# Altium project FastestCar_Ctl.PrjPcb
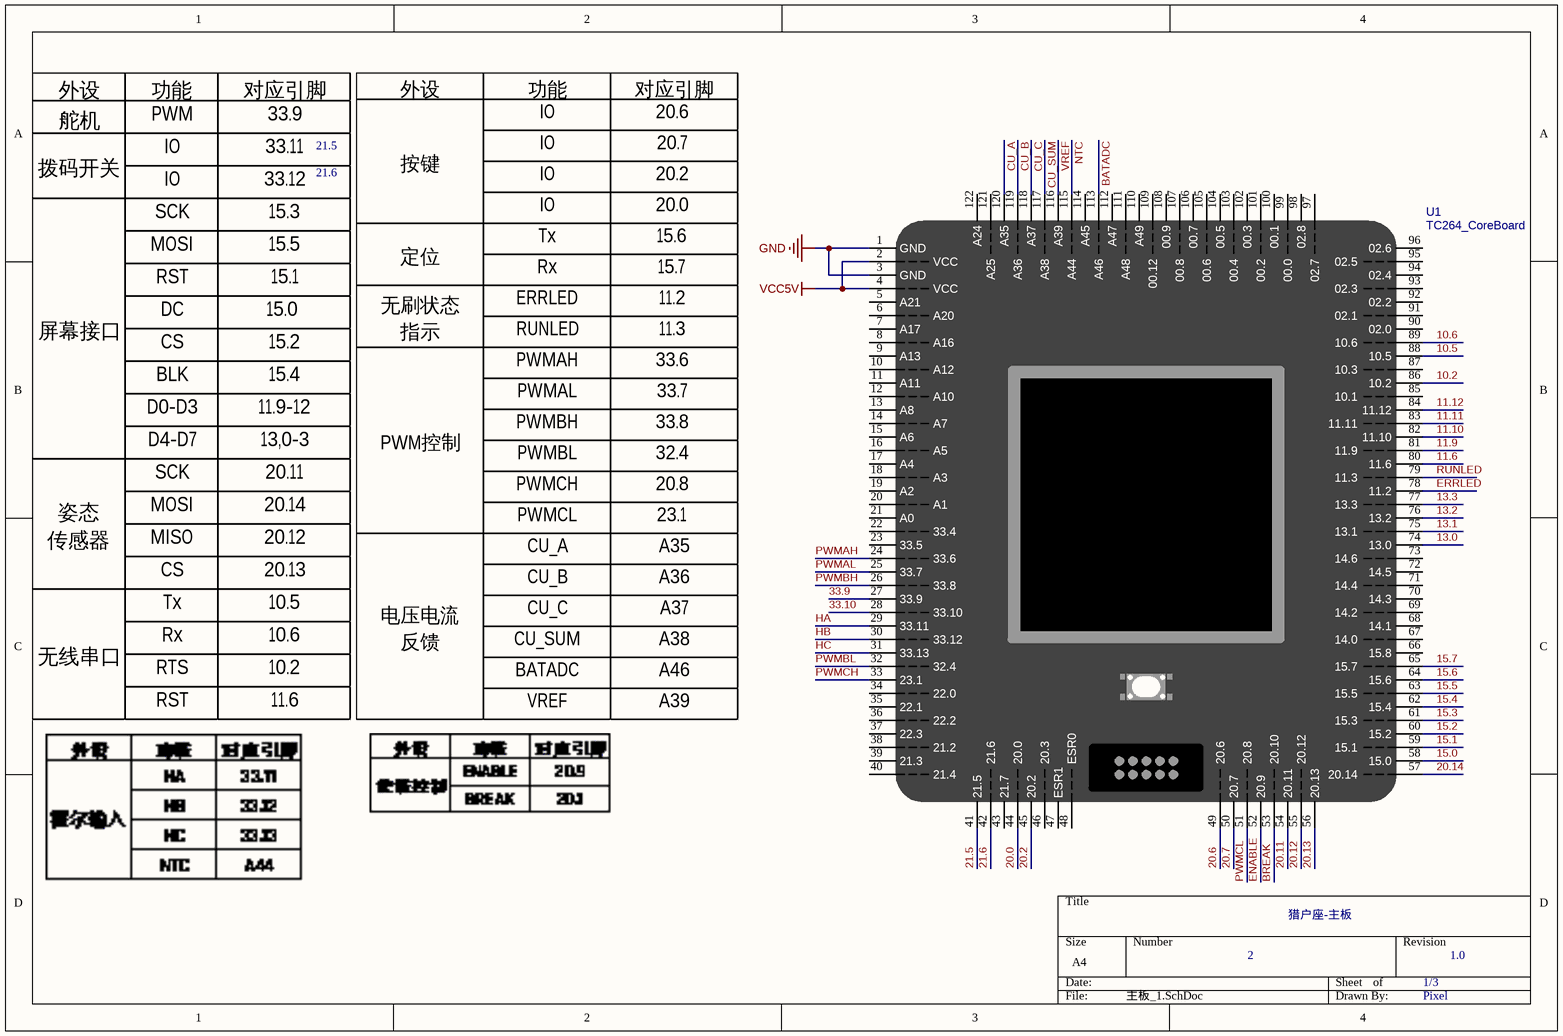
[diagram p0: 主板_1.SchDoc]
3 sheets, 125 parts. Net scope: global (net labels, ports and power ports of the same name join across sheets).
Board file: 主板.PcbDoc
Sheets:
  主板_1.SchDoc
  主板_2.SchDoc
  主板_3.SchDoc

## Sheet 主板_1.SchDoc
size A4; SheetNumber: 1; SheetTotal: 3

### Parts
U1  TC264_CoreBoard  [TC264_CoreBoard]

### Nets
GND: U1.1(GND) U1.3(GND)
VCC5V: U1.2(VCC) U1.4(VCC)
10.2: U1.86(10.2)
10.5: U1.88(10.5)
10.6: U1.89(10.6)
11.6: U1.80(11.6)
11.9: U1.81(11.9)
11.10: U1.82(11.10)
11.11: U1.83(11.11)
11.12: U1.84(11.12)
13.0: U1.74(13.0)
13.1: U1.75(13.1)
13.2: U1.76(13.2)
13.3: U1.77(13.3)
15.0: U1.58(15.0)
15.1: U1.59(15.1)
15.2: U1.60(15.2)
15.3: U1.61(15.3)
15.4: U1.62(15.4)
15.5: U1.63(15.5)
15.6: U1.64(15.6)
15.7: U1.65(15.7)
20.0: U1.44(20.0)
20.2: U1.45(20.2)
20.6: U1.49(20.6)
20.7: U1.50(20.7)
20.11: U1.54(20.11)
20.12: U1.55(20.12)
20.13: U1.56(20.13)
20.14: U1.57(20.14)
21.5: U1.41(21.5)
21.6: U1.42(21.6)
33.9: U1.27(33.9)
33.10: U1.28(33.10)
BATADC: U1.113(A46)
BREAK: U1.53(20.10)
CU_A: U1.120(A35)
CU_B: U1.119(A36)
CU_C: U1.118(A37)
CU_SUM: U1.117(A38)
ENABLE: U1.52(20.9)
ERRLED: U1.78(11.2)
HA: U1.29(33.11)
HB: U1.30(33.12)
HC: U1.31(33.13)
NTC: U1.115(A44)
PWMAH: U1.24(33.6)
PWMAL: U1.25(33.7)
PWMBH: U1.26(33.8)
PWMBL: U1.32(32.4)
PWMCH: U1.33(23.1)
PWMCL: U1.51(20.8)
RUNLED: U1.79(11.3)
VREF: U1.116(A39)

Not connected (* = marked no-connect by the designer): U1 5(A21) 6(A20) 7(A17) 8(A16) 9(A13) 10(A12) 11(A11) 12(A10) 13(A8) 14(A7) 15(A6) 16(A5) 17(A4) 18(A3) 19(A2) 20(A1) 21(A0) 22(33.4) 23(33.5) 34(22.0) 35(22.1) 36(22.2) 37(22.3) 38(21.2) 39(21.3) 40(21.4) 43(21.7) 46(20.3) 47(ESR1) 48(ESR0) 66(15.8) 67(14.0) 68(14.1) 69(14.2) 70(14.3) 71(14.4) 72(14.5) 73(14.6) 85(10.1) 87(10.3) 90(02.0) 91(02.1) 92(02.2) 93(02.3) 94(02.4) 95(02.5) 96(02.6) 97(02.7) 98(02.8) 99(00.0) 100(00.1) 101(00.2) 102(00.3) 103(00.4) 104(00.5) 105(00.6) 106(00.7) 107(00.8) 108(00.9) 109(00.12) 110(A49) 111(A48) 112(A47) 114(A45) 121(A25) 122(A24)

### Notes on the sheet
- 21.5
- 21.6
- 猎户座-主板
- 2
- 1/3
- 1.0
- Pixel

### Library data of the parts
U1 = TC264_CoreBoard: 逐飞科技TC264核心板

## Sheet 主板_2.SchDoc
size A4; SheetNumber: 2; SheetTotal: 3
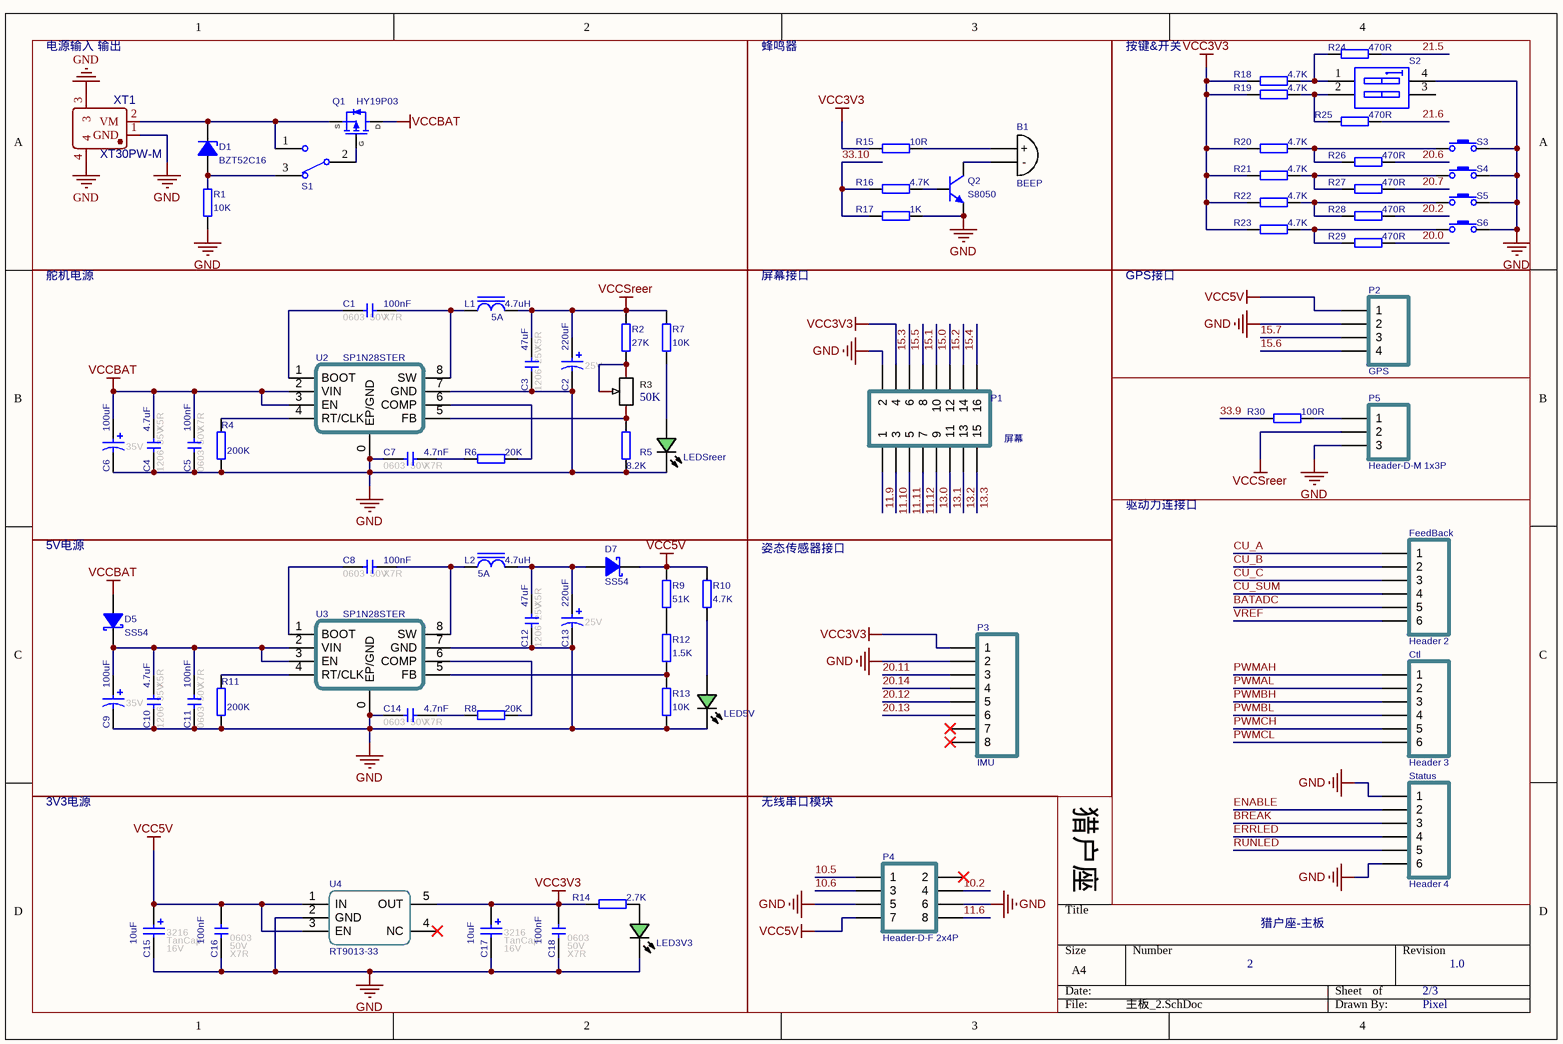
[diagram p1: 主板_2.SchDoc]

### Parts
B1  BEEP  [BEEP 9x5.5mm]
C1  value 100nF  FootPrint: 0603  Voltage: 50V  Type: X7R  [CAPC1608[0603]S-N]  (hidden comment: 100nF 50V X7R)
C2  value 220uF  Voltage: 25V  [CAP-E-S 6.3]  (hidden comment: 220uF 25V 铝电解)
C3  value 47uF  FootPrint: 1206  Voltage: 25V  Type: X5R  [CAPC3216[1206]S]  (hidden comment: 47uF 25V X5R)
C4  value 4.7uF  FootPrint: 1206  Voltage: 35V  Type: X5R  [CAPC3216[1206]S]  (hidden comment: 4.7uF 35V X5R)
C5  value 100nF  FootPrint: 0603  Voltage: 50V  Type: X7R  [CAPC1608[0603]S-N]  (hidden comment: 100nF 50V X7R)
C6  value 100uF  Voltage: 35V  [CAP-E-S 6.3]  (hidden comment: 100uF 35V 铝电解)
C7  value 4.7nF  FootPrint: 0603  Voltage: 50V  Type: X7R  [CAPC1608[0603]S-N]  (hidden comment: 4.7nF 50V X7R)
C8  value 100nF  FootPrint: 0603  Voltage: 50V  Type: X7R  [CAPC1608[0603]S-N]  (hidden comment: 100nF 50V X7R)
C9  value 100uF  Voltage: 35V  [CAP-E-S 6.3]  (hidden comment: 100uF 35V 铝电解)
C10  value 4.7uF  FootPrint: 1206  Voltage: 35V  Type: X5R  [CAPC3216[1206]S]  (hidden comment: 4.7uF 35V X5R)
C11  value 100nF  FootPrint: 0603  Voltage: 50V  Type: X7R  [CAPC1608[0603]S-N]  (hidden comment: 100nF 50V X7R)
C12  value 47uF  FootPrint: 1206  Voltage: 25V  Type: X5R  [CAPC3216[1206]S]  (hidden comment: 47uF 25V X5R)
C13  value 220uF  Voltage: 25V  [CAP-E-S 6.3]  (hidden comment: 220uF 25V 铝电解)
C14  value 4.7nF  FootPrint: 0603  Voltage: 50V  Type: X7R  [CAPC1608[0603]S-N]  (hidden comment: 4.7nF 50V X7R)
C15  value 10uF  FootPrint: 3216  Type: TanCap  Voltage: 16V  [CAP-T-S 3216]  (hidden comment: 10uF 16V 钽电容)
C16  value 100nF  FootPrint: 0603  Voltage: 50V  Type: X7R  [CAPC1608[0603]S-N]  (hidden comment: 100nF 50V X7R)
C17  value 10uF  FootPrint: 3216  Type: TanCap  Voltage: 16V  [CAP-T-S 3216]  (hidden comment: 10uF 16V 钽电容)
C18  value 100nF  FootPrint: 0603  Voltage: 50V  Type: X7R  [CAPC1608[0603]S-N]  (hidden comment: 100nF 50V X7R)
Ctl  Header 3  [ZH1.5-6P-SH]
D1  BZT52C16  [SOD-123-L]
D5  SS54  [SMA-L[DO-214AC]]
D7  SS54  [SMA-L[DO-214AC]]
FeedBack  Header 2  [ZH1.5-6P-SH]
L1  value 4.7uH  Imax: 5A  [0630 TPC 7*7*3]  (hidden comment: 4.7uH 5A)
L2  value 4.7uH  Imax: 5A  [0630 TPC 7*7*3]  (hidden comment: 4.7uH 5A)
LED3V3  翠绿贴片LED  [LEDC1608(0603)-L]  (value not drawn)
LED5V  翠绿贴片LED  [LEDC1608(0603)-L]  (value not drawn)
LEDSreer  翠绿贴片LED  [LEDC1608(0603)-L]  (value not drawn)
P1  屏幕  [HDR2X8-F]
P2  GPS  [HDR1X4-M]
P3  IMU  [HDR1X8-M]
P4  Header-D-F 2x4P  [HDR2X4-F]
P5  Header-D-M 1x3P  [HDR1X3-M]
Q1  HY19P03  [TO-252AA]
Q2  S8050  [SOT-23]
R1  value 10K  [RESC1608[0603]S-N]  (hidden comment: 10K ±1%)
R2  value 27K  [RESC1608[0603]S-N]  (hidden comment: 27K ±1%)
R3  3362P-1-503  [RES-ADJ-TH_3P-L7.1-W6.9-P2.50-L_3362P]  (value not drawn)
R4  value 200K  [RESC1608[0603]S-N]  (hidden comment: 200K ±1%)
R5  value 8.2K  [RESC1608[0603]S-N]  (hidden comment: 8.2K ±1%)
R6  value 20K  [RESC1608[0603]S-N]  (hidden comment: 20K ±1%)
R7  value 10K  [RESC1608[0603]S-N]  (hidden comment: 10K ±1%)
R8  value 20K  [RESC1608[0603]S-N]  (hidden comment: 20K ±1%)
R9  value 51K  [RESC1608[0603]S-N]  (hidden comment: 51K ±1%)
R10  value 4.7K  [RESC1608[0603]S-N]  (hidden comment: 4.7K ±1%)
R11  value 200K  [RESC1608[0603]S-N]  (hidden comment: 200K ±1%)
R12  value 1.5K  [RESC1608[0603]S-N]  (hidden comment: 1.5K ±1%)
R13  value 10K  [RESC1608[0603]S-N]  (hidden comment: 10K ±1%)
R14  value 2.7K  [RESC1608[0603]S-N]  (hidden comment: 2.7K ±1%)
R15  value 10R  [RESC1608[0603]S-N]  (hidden comment: 10R ±1%)
R16  value 4.7K  [RESC1608[0603]S-N]  (hidden comment: 4.7K ±1%)
R17  value 1K  [RESC1608[0603]S-N]  (hidden comment: 1K ±1%)
R18  value 4.7K  [RESC1608[0603]S-N]  (hidden comment: 4.7K ±1%)
R19  value 4.7K  [RESC1608[0603]S-N]  (hidden comment: 4.7K ±1%)
R20  value 4.7K  [RESC1608[0603]S-N]  (hidden comment: 4.7K ±1%)
R21  value 4.7K  [RESC1608[0603]S-N]  (hidden comment: 4.7K ±1%)
R22  value 4.7K  [RESC1608[0603]S-N]  (hidden comment: 4.7K ±1%)
R23  value 4.7K  [RESC1608[0603]S-N]  (hidden comment: 4.7K ±1%)
R24  value 470R  [RESC1608[0603]S-N]  (hidden comment: 470R ±1%)
R25  value 470R  [RESC1608[0603]S-N]  (hidden comment: 470R ±1%)
R26  value 470R  [RESC1608[0603]S-N]  (hidden comment: 470R ±1%)
R27  value 470R  [RESC1608[0603]S-N]  (hidden comment: 470R ±1%)
R28  value 470R  [RESC1608[0603]S-N]  (hidden comment: 470R ±1%)
R29  value 470R  [RESC1608[0603]S-N]  (hidden comment: 470R ±1%)
R30  value 100R  [RESC1608[0603]S-N]  (hidden comment: 100R ±1%)
S1  SW-SPDT  [SS12D10]  (value not drawn)
S2  SW DIP-2  [Code SW-2-DIP-2.54]  (value not drawn)
S3  Button  [PTS810-3*4-CurvePin]  (value not drawn)
S4  Button  [PTS810-3*4-CurvePin]  (value not drawn)
S5  Button  [PTS810-3*4-CurvePin]  (value not drawn)
S6  Button  [PTS810-3*4-CurvePin]  (value not drawn)
Status  Header 4  [ZH1.5-6P-SH]
U2  SP1N28STER  [SOP-8E]
U3  SP1N28STER  [SOP-8E]
U4  RT9013-33  [SOT-23-5]
XT1  XT30PW-M  [XT30PW-M]

### Blocks framed on the sheet
电源输入 输出: D1 Q1 R1 S1 XT1
蜂鸣器: B1 Q2 R15-R17
按键&开关: R18-R29 S2-S6
舵机电源: C1-C7 L1 LEDSreer R2-R7 U2
屏幕接口: P1
GPS接口: P2 P5 R30
驱动力连接口: Ctl FeedBack Status
5V电源: C8-C14 D5 D7 L2 LED5V R8-R13 U3
姿态传感器接口: P3
3V3电源: C15-C18 LED3V3 R14 U4
无线串口模块: P4

### Nets
GND: C2.2 C3.1 C4.1 C5.1 C6.2 C7.1 C9.2 C10.1 C11.1 C12.1 C13.2 C14.1 C15.2 C16.1 C17.2 C18.1 LED3V3.C LED5V.C LEDSreer.C P1.2 P2.2 P3.2 P4.5 P4.6 P5.3 Q2.2(E) R1.1 R4.1 R5.1 R11.1 R13.1 R17.2 S2.4(B1) S3.1 S4.1 S5.1 S6.1 Status.1 Status.6 U2.0(EP/GND) U2.7(GND) U3.0(EP/GND) U3.7(GND) U4.2(GND) XT1.1(GND) XT1.3 XT1.4
VCC3V3: C17.1 C18.2 P1.4 P3.1 R14.1 R15.1 R18.1 R19.1 R20.1 R21.1 R22.1 R23.1 U4.5(OUT)
VCC5V: C15.1 C16.2 D7.K P2.1 P4.7 R9.2 R10.2 U4.1(IN) U4.3(EN)
VCCBAT: C4.2 C5.2 C6.1 D5.A Q1.1(D) U2.2(VIN) U2.3(EN)
VCCSreer: C2.1 C3.2 L1.2 P5.2 R2.2 R7.2
10.2: P4.4
10.5: P4.1
10.6: P4.3
11.6: P4.8
11.9: P1.1
11.10: P1.3
11.11: P1.5
11.12: P1.7
13.0: P1.9
13.1: P1.11
13.2: P1.13
13.3: P1.15
15.0: P1.12
15.1: P1.10
15.2: P1.14
15.3: P1.6
15.4: P1.16
15.5: P1.8
15.6: P2.4
15.7: P2.3
20.0: R29.2
20.2: R28.2
20.6: R26.2
20.7: R27.2
20.11: P3.3
20.12: P3.5
20.13: P3.6
20.14: P3.4
21.5: R24.2
21.6: R25.2
33.9: R30.1
33.10: R16.1 R17.1
BATADC: FeedBack.5
BREAK: Status.3
CU_A: FeedBack.1
CU_B: FeedBack.2
CU_C: FeedBack.3
CU_SUM: FeedBack.4
ENABLE: Status.2
ERRLED: Status.4
PWMAH: Ctl.1
PWMAL: Ctl.2
PWMBH: Ctl.3
PWMBL: Ctl.4
PWMCH: Ctl.5
PWMCL: Ctl.6
RUNLED: Status.5
VREF: FeedBack.6
NetB1_1: B1.1(+) R15.2
NetB1_2: B1.2(-) Q2.3(C)
NetC1_1: C1.1 U2.1(BOOT)
NetC1_2: C1.2 L1.1 U2.8(SW)
NetC7_2: C7.2 R6.1
NetC8_1: C8.1 U3.1(BOOT)
NetC8_2: C8.2 L2.1 U3.8(SW)
NetC9_1: C9.1 C10.2 C11.2 D5.K U3.2(VIN) U3.3(EN)
NetC12_2: C12.2 C13.1 D7.A L2.2
NetC14_2: C14.2 R8.1
NetD1_A: D1.A R1.2 S1.3
NetD1_K: D1.K Q1.3(S) S1.1 XT1.2(VM)
NetLED3V3_A: LED3V3.A R14.2
NetLED5V_A: LED5V.A R10.1
NetLEDSreer_A: LEDSreer.A R7.1
NetP5_1: P5.1 R30.2
NetQ1_2: Q1.2(G) S1.2
NetQ2_1: Q2.1(B) R16.2
NetR2_1: R2.1 R3.2 R3.3
NetR3_1: R3.1 R5.2 U2.5(FB)
NetR4_2: R4.2 U2.4(RT/CLK)
NetR6_2: R6.2 U2.6(COMP)
NetR8_2: R8.2 U3.6(COMP)
NetR9_1: R9.1 R12.2
NetR11_2: R11.2 U3.4(RT/CLK)
NetR12_1: R12.1 R13.2 U3.5(FB)
NetR18_2: R18.2 R24.1 S2.1(A1)
NetR19_2: R19.2 R25.1 S2.2(A2)
NetR20_2: R20.2 R26.1 S3.2
NetR21_2: R21.2 R27.1 S4.2
NetR22_2: R22.2 R28.1 S5.2
NetR23_2: R23.2 R29.1 S6.2

Not connected (* = marked no-connect by the designer): P3 7* 8*; P4 2*; S2 3(B2); U4 4(NC)*

### Notes on the sheet
- 猎户座
- 猎户座-主板
- 2
- 2/3
- 1.0
- Pixel
- (in symbol RES-ADJ-50k(10%)) 50K

### Library data of the parts
B1 = BEEP: 蜂鸣器
C1 C5 C8 C11 C16 C18 = 100nF 0603 50V X7R: 贴片瓷片电容; MLCC; 0603(1608);; Revision: V1.0
C2 C13 = E-S 220uF 25V 6.3x7.7: 贴片电解电容 220uF 25V 6.3x7.7; Revision: V1.0; Type: 铝电解
C3 C12 = 47uF 1206 25V X5R: 贴片瓷片电容; MLCC; 1206(3216);; Revision: V1.0
C4 C10 = 4.7uF 1206 35V X5R: 贴片瓷片电容; MLCC; 1206(3216);; Revision: V1.0
C6 C9 = E-S 100uF 35V 6.3x7.7: 贴片电解电容 100uF 35V 6.3x7.7; Revision: V1.0; Type: 铝电解
C7 C14 = 4.7nF 0603 50V X7R: 贴片瓷片电容; MLCC; 0603(1608);; Revision: V1.0
C15 C17 = T-S 10uF 3216 16V: 贴片钽电容 10uF 3216 16V; Revision: July-2002: Re-released for DXP Platform.
Ctl FeedBack Status = Header 6: Header, 6-Pin; System: Connector; LatestRevisionDate: 17-Jul-2002; LatestRevisionNote: Re-released for DXP Platform.; Publisher: Altium Limited; Price(RMB): 0.00
D1 = Diode Zen: 稳压二极管 齐纳二极管  Zener Diode; Published: 8-Jun-2000; Revision: July-2002: Re-released for DXP Platform.; Publisher: Altium Limited; Price(RMB): 0.000
D5 D7 = SS54: SS54 肖特基二极管; Revision: V1.0; Value: SS54
L1 L2 = Ind-Power: 功率电感; DCR: .5m; Published: 8-Jun-2000; Revision: July-2002: Re-released for DXP Platform.; Publisher: Altium Limited; Price(RMB): 0.000
LED3V3 LED5V LEDSreer = LED Chip Green: Published: 8-Jun-2000; Revision: July-2002: Re-released for DXP Platform.; Publisher: Altium Limited; Price(RMB): 0.00
P1 = Header-D-F 2x8P: 2x8pin, 直插, 双排座; Revision: V1.0; Value: 屏幕
P2 = Header-D-M 1x4P: 1x4pin, 直插, 排针; Revision: V1.0; Value: GPS
P3 = Header-D-M 1x8P: 1x8pin, 直插, 排针; Revision: V1.0; Value: IMU
P4 = Header-D-F 2x4P: 2x4pin, 直插, 双排座; Revision: V1.0; Value: Header-D-F 2x4P
P5 = Header-D-M 1x3P: 1x3pin, 直插, 排针; Revision: V1.0; Value: Header-D-M 1x3P
Q1 = HY19P03: HY19P03 P-Channel MOSFET
Q2 = NPN S8050: NPN 三极管; Published: 8-Jun-2000; Revision: July-2002: Re-released for DXP Platform.; Publisher: Altium Limited; Price(RMB): 0.000; PartNumber: S8050
R1 R7 R13 = Res-Chip: 贴片电阻; Power: 1/8W; Revision: V1.0; Tolerance: ±1%
R2 R9 = Res-Chip_7: 贴片电阻; Power: 1/8W; Revision: V1.0; Tolerance: ±1%
R3 = RES-ADJ-50k(10%): Designer: U?; Name: RES-ADJ-50K(10%); Symbol: 3362P-1-503; Device: 3362P-1-503
R4 R11 = Res-Chip_1: 贴片电阻; Power: 1/8W; Revision: V1.0; Tolerance: ±1%
R5 = Res-Chip_8: 贴片电阻; Power: 1/8W; Revision: V1.0; Tolerance: ±1%
R6 R8 = Res-Chip_4: 贴片电阻; Power: 1/8W; Revision: V1.0; Tolerance: ±1%
R10 R16 R18-R23 = Res-Chip_3: 贴片电阻; Power: 1/8W; Revision: V1.0; Tolerance: ±1%
R12 = Res-Chip_5: 贴片电阻; Power: 1/8W; Revision: V1.0; Tolerance: ±1%
R14 = Res-Chip_6: 贴片电阻; Power: 1/8W; Revision: V1.0; Tolerance: ±1%
R15 = Res-Chip_10: 贴片电阻; Power: 1/8W; Revision: V1.0; Tolerance: ±1%
R17 = Res-Chip_11: 贴片电阻; Power: 1/8W; Revision: V1.0; Tolerance: ±1%
R24-R29 = Res-Chip_12: 贴片电阻; Power: 1/8W; Revision: V1.0; Tolerance: ±1%
R30 = Res-Chip_9: 贴片电阻; Power: 1/8W; Revision: V1.0; Tolerance: ±1%
S1 = SW-SPDT: 单刀双掷开关 3脚船型、钮子、拨动开关 SPDT Subminiature Toggle Switch; Published: 24-Mar-1999; Publisher: Altium Limited; Price(RMB): 0.000
S2 = Code SW-2: 2位拨码开关; Published: 24-Mar-1999; Revision: July-2002: Re-released for DXP Platform.; Publisher: Altium Limited; Price(RMB): 0.000
S3-S6 = KEY: 按键; Published: 24-Mar-1999; Publisher: Altium Limited; Price(RMB): 0.000
U4 = RT9013-33: 3.3V 500mA SOT-23-5 LDO
U2 U3 = SP1N28STER: Revision: V1.0; Value: SP1N28STER

## Sheet 主板_3.SchDoc
size A4; SheetNumber: 3; SheetTotal: 3
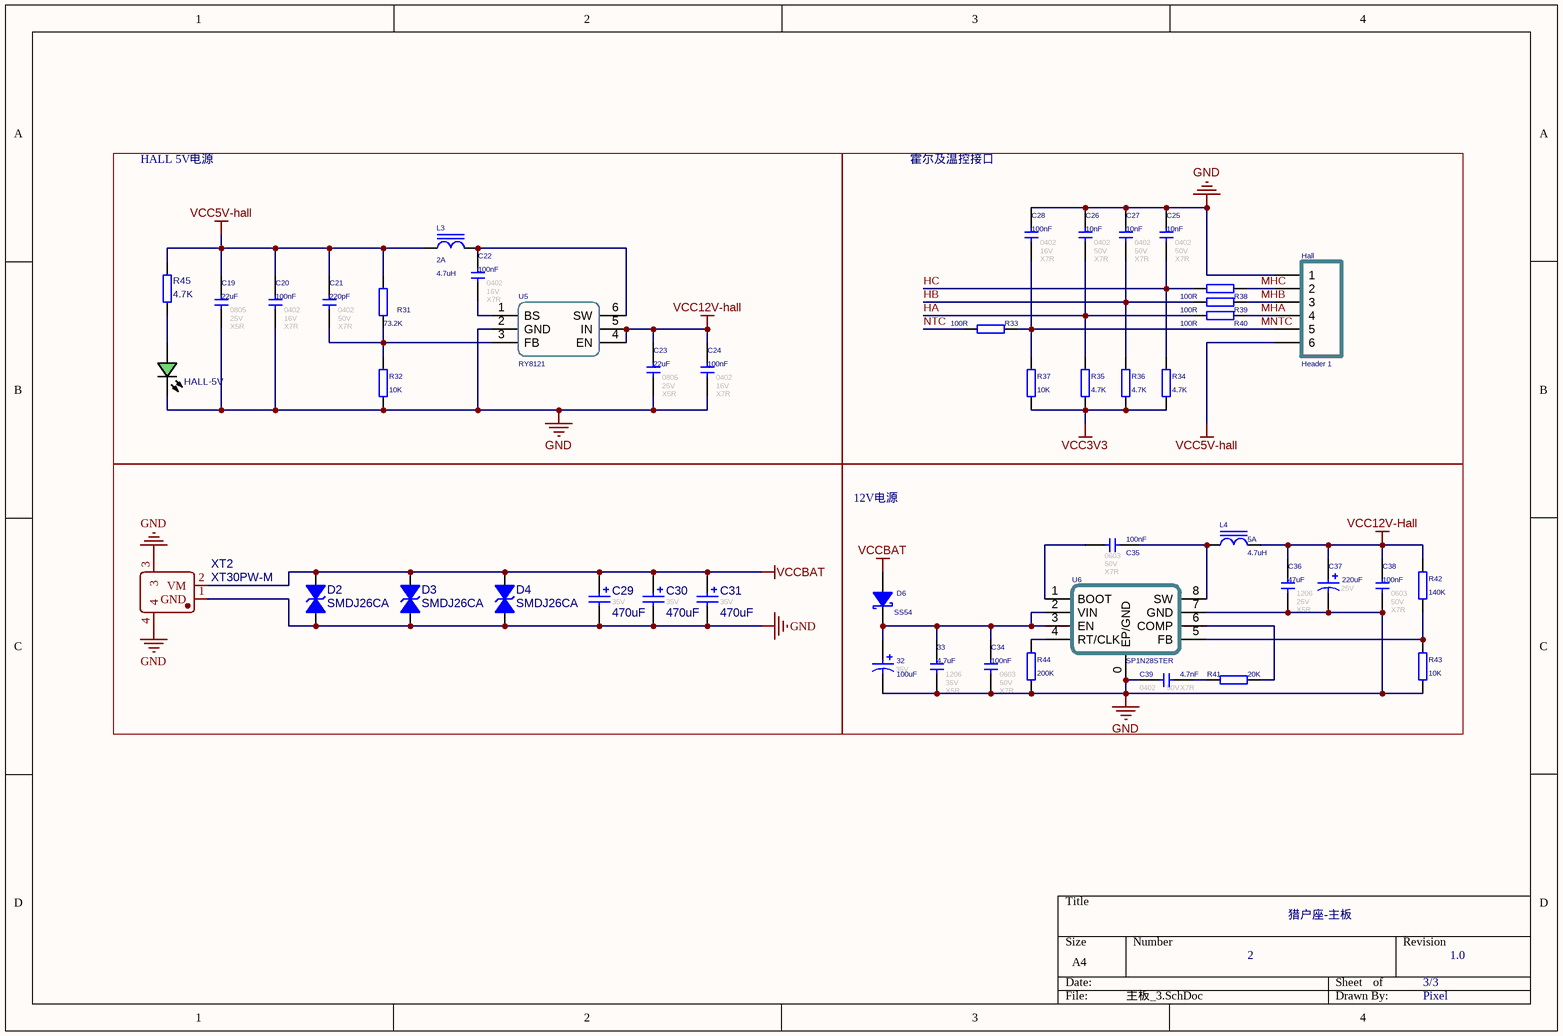
[diagram p2: 主板_3.SchDoc]

### Parts
32  value 100uF  Voltage: 35V  [CAP-E-S 6.3]  (hidden comment: 100uF 35V 铝电解)
33  value 4.7uF  FootPrint: 1206  Voltage: 35V  Type: X5R  [CAPC3216[1206]S]  (hidden comment: 4.7uF 35V X5R)
C19  value 22uF  FootPrint: 0805  Voltage: 25V  Type: X5R  [CAPC2012[0805]S-N]  (hidden comment: 22uF 25V X5R)
C20  value 100nF  FootPrint: 0402  Voltage: 16V  Type: X7R  [CAPC1005[0402]S-N]  (hidden comment: 100nF 16V X7R)
C21  value 220pF  FootPrint: 0402  Voltage: 50V  Type: X7R  [CAPC1005[0402]S-N]  (hidden comment: 220pF 50V X7R)
C22  value 100nF  FootPrint: 0402  Voltage: 16V  Type: X7R  [CAPC1005[0402]S-N]  (hidden comment: 100nF 16V X7R)
C23  value 22uF  FootPrint: 0805  Voltage: 25V  Type: X5R  [CAPC2012[0805]S-N]  (hidden comment: 22uF 25V X5R)
C24  value 100nF  FootPrint: 0402  Voltage: 16V  Type: X7R  [CAPC1005[0402]S-N]  (hidden comment: 100nF 16V X7R)
C25  value 10nF  FootPrint: 0402  Voltage: 50V  Type: X7R  [CAPC1005[0402]S-N]  (hidden comment: 10nF 50V X7R)
C26  value 10nF  FootPrint: 0402  Voltage: 50V  Type: X7R  [CAPC1005[0402]S-N]  (hidden comment: 10nF 50V X7R)
C27  value 10nF  FootPrint: 0402  Voltage: 50V  Type: X7R  [CAPC1005[0402]S-N]  (hidden comment: 10nF 50V X7R)
C28  value 100nF  FootPrint: 0402  Voltage: 16V  Type: X7R  [CAPC1005[0402]S-N]  (hidden comment: 100nF 16V X7R)
C29  value 470uF  Voltage: 35V  [Cap-S-D 3.5-8x14]  (hidden comment: 470uF 35V 聚合物固态)
C30  value 470uF  Voltage: 35V  [Cap-S-D 3.5-8x14]  (hidden comment: 470uF 35V 聚合物固态)
C31  value 470uF  Voltage: 35V  [Cap-S-D 3.5-8x14]  (hidden comment: 470uF 35V 聚合物固态)
C34  value 100nF  FootPrint: 0603  Voltage: 50V  Type: X7R  [CAPC1608[0603]S-N]  (hidden comment: 100nF 50V X7R)
C35  value 100nF  FootPrint: 0603  Voltage: 50V  Type: X7R  [CAPC1608[0603]S-N]  (hidden comment: 100nF 50V X7R)
C36  value 47uF  FootPrint: 1206  Voltage: 25V  Type: X5R  [CAPC3216[1206]S]  (hidden comment: 47uF 25V X5R)
C37  value 220uF  Voltage: 25V  [CAP-E-S 6.3]  (hidden comment: 220uF 25V 铝电解)
C38  value 100nF  FootPrint: 0603  Voltage: 50V  Type: X7R  [CAPC1608[0603]S-N]  (hidden comment: 100nF 50V X7R)
C39  value 4.7nF  FootPrint: 0402  Voltage: 50V  Type: X7R  [CAPC1005[0402]S-N]  (hidden comment: 4.7nF 50V X7R)
D2  SMDJ26CA  [SMC[DO-214AB]-Bi]
D3  SMDJ26CA  [SMC[DO-214AB]-Bi]
D4  SMDJ26CA  [SMC[DO-214AB]-Bi]
D6  SS54  [SMA-L[DO-214AC]]
Hall  Header 1  [ZH1.5-6P-SH]
HALL-5V  翠绿贴片LED  [LEDC1608(0603)-L]  (value not drawn)
L3  value 4.7uH  Imax: 2A  [SLO2520]  (hidden comment: 4.7uH 2A)
L4  value 4.7uH  Imax: 5A  [SLO2520]  (hidden comment: 4.7uH 5A)
R31  value 73.2K  [RESC1005[0402]S-N]  (hidden comment: 73.2K ±1%)
R32  value 10K  [RESC1005[0402]S-N]  (hidden comment: 10K ±1%)
R33  value 100R  [RESC1005[0402]S-N]  (hidden comment: 100R ±1%)
R34  value 4.7K  [RESC1005[0402]S-N]  (hidden comment: 4.7K ±1%)
R35  value 4.7K  [RESC1005[0402]S-N]  (hidden comment: 4.7K ±1%)
R36  value 4.7K  [RESC1005[0402]S-N]  (hidden comment: 4.7K ±1%)
R37  value 10K  [RESC1005[0402]S-N]  (hidden comment: 10K ±1%)
R38  value 100R  [RESC1005[0402]S-N]  (hidden comment: 100R ±1%)
R39  value 100R  [RESC1005[0402]S-N]  (hidden comment: 100R ±1%)
R40  value 100R  [RESC1005[0402]S-N]  (hidden comment: 100R ±1%)
R41  value 20K  [RESC1005[0402]S-N]  (hidden comment: 20K ±1%)
R42  value 140K  [RESC1005[0402]S-N]  (hidden comment: 140K ±1%)
R43  value 10K  [RESC1005[0402]S-N]  (hidden comment: 10K ±1%)
R44  value 200K  [RESC1005[0402]S-N]  (hidden comment: 200K ±1%)
R45  value 4.7K  [RESC1608[0603]S-N]  (hidden comment: 4.7K ±1%)
U5  RY8121  [SOT-23-6]
U6  SP1N28STER  [SOP-8E]
XT2  XT30PW-M  [XT30PW-M]

### Blocks framed on the sheet
HALL 5V电源: C19-C24 HALL-5V L3 R31 R32 R45 U5
霍尔及温控接口: C25-C28 Hall R33-R40
12V电源: 32 33 C34-C39 D6 L4 R41-R44 U6

### Nets
GND: 32.2 33.1 C19.1 C20.1 C23.1 C24.1 C25.2 C26.2 C27.2 C28.2 C29.2 C30.2 C31.2 C34.1 C36.1 C37.2 C38.1 C39.1 D2.A D3.A D4.A Hall.1 HALL-5V.C R32.1 R43.1 R44.1 U5.2(GND) U6.0(EP/GND) U6.7(GND) XT2.1(GND) XT2.3 XT2.4
VCC3V3: R34.1 R35.1 R36.1 R37.1
VCC5V-hall: C19.2 C20.2 C21.2 Hall.6 L3.1 R31.2 R45.2
VCC12V-hall: C23.2 C24.2 C36.2 C37.1 C38.2 L4.2 R42.2 U5.4(EN) U5.5(IN)
VCCBAT: C29.1 C30.1 C31.1 D2.K D3.K D4.K D6.A XT2.2(VM)
HA: C26.1 R35.2 R40.1
HB: C27.1 R36.2 R39.1
HC: C25.1 R34.2 R38.1
MHA: Hall.4 R40.2
MHB: Hall.3 R39.2
MHC: Hall.2 R38.2
MNTC: C28.1 Hall.5 R33.2 R37.2
NTC: R33.1
Net32_1: 32.1 33.2 C34.2 D6.K U6.2(VIN) U6.3(EN)
NetC21_1: C21.1 R31.1 R32.2 U5.3(FB)
NetC22_1: C22.1 U5.1(BS)
NetC22_2: C22.2 L3.2 U5.6(SW)
NetC35_1: C35.1 U6.1(BOOT)
NetC35_2: C35.2 L4.1 U6.8(SW)
NetC39_2: C39.2 R41.1
NetHALL-5V_A: HALL-5V.A R45.1
NetR41_2: R41.2 U6.6(COMP)
NetR42_1: R42.1 R43.2 U6.5(FB)
NetR44_2: R44.2 U6.4(RT/CLK)

### Notes on the sheet
- 猎户座-主板
- 2
- 3/3
- 1.0
- Pixel

### Library data of the parts
32 = E-S 100uF 35V 6.3x7.7: 贴片电解电容 100uF 35V 6.3x7.7; Revision: V1.0; Type: 铝电解
33 = 4.7uF 1206 35V X5R: 贴片瓷片电容; MLCC; 1206(3216);; Revision: V1.0
C19 C23 = 22uF 0805 25V X5R: 贴片瓷片电容; MLCC; 0805(2012);; Revision: V1.0
C20 C22 C24 C28 = 100nF 0402 16V X7R: 贴片瓷片电容; MLCC; 0402(1005);; Revision: V1.0
C21 = 220pF 0402 50V X7R: 贴片瓷片电容; MLCC; 0402(1005);; Revision: V1.0
C25-C27 = 10nF 0402 50V X7R: 贴片瓷片电容; MLCC; 0402(1005);; Revision: V1.0
C29-C31 = S-D 470uF 35V 8x14: 直插固态电容 470uF 35V 8x14; Revision: V1.0; Type: 聚合物固态
C34 C35 C38 = 100nF 0603 50V X7R: 贴片瓷片电容; MLCC; 0603(1608);; Revision: V1.0
C36 = 47uF 1206 25V X5R: 贴片瓷片电容; MLCC; 1206(3216);; Revision: V1.0
C37 = E-S 220uF 25V 6.3x7.7: 贴片电解电容 220uF 25V 6.3x7.7; Revision: V1.0; Type: 铝电解
C39 = 4.7nF 0402 50V X7R: 贴片瓷片电容; MLCC; 0402(1005);; Revision: V1.0
D2-D4 = Diode TVS Bi-Dir: TRANSIENT VOLTAGE  SUPPRESSOR DIODE; Imax: 500mA; Published: 8-Jun-2000; Publisher: Altium Limited; Price(RMB): 0.000
D6 = SS54: SS54 肖特基二极管; Revision: V1.0; Value: SS54
Hall = Header 6: Header, 6-Pin; LatestRevisionDate: 17-Jul-2002; LatestRevisionNote: Re-released for DXP Platform.; Publisher: Altium Limited; Price(RMB): 0.00
HALL-5V = LED Chip Green: Published: 8-Jun-2000; Revision: July-2002: Re-released for DXP Platform.; Publisher: Altium Limited; Price(RMB): 0.00
L3 L4 = Ind-Power: 功率电感; DCR: .5m; Published: 8-Jun-2000; Revision: July-2002: Re-released for DXP Platform.; Publisher: Altium Limited; Price(RMB): 0.000
R31 = Res-Chip_8: 贴片电阻; Power: 1/8W; Revision: V1.0; Tolerance: ±1%
R32 R37 R43 = Res-Chip_1: 贴片电阻; Power: 1/8W; Revision: V1.0; Tolerance: ±1%
R33 R38-R40 = Res-Chip_5: 贴片电阻; Power: 1/8W; Revision: V1.0; Tolerance: ±1%
R34-R36 = Res-Chip_4: 贴片电阻; Power: 1/8W; Revision: V1.0; Tolerance: ±1%
R41 = Res-Chip_7: 贴片电阻; Power: 1/8W; Revision: V1.0; Tolerance: ±1%
R42 = Res-Chip_11: 贴片电阻; Power: 1/8W; Revision: V1.0; Tolerance: ±1%
R44 = Res-Chip_10: 贴片电阻; Power: 1/8W; Revision: V1.0; Tolerance: ±1%
R45 = Res-Chip_3: 贴片电阻; Power: 1/8W; Revision: V1.0; Tolerance: ±1%
U5 = RY8121: 18V 2A 1MHz Synchronous Step-Down Regulator
XT2 = XT30PW-M: System: Connector
U6 = SP1N28STER: Revision: V1.0; Value: SP1N28STER

## Nets that join several sheets
GND: 主板_1 (U1.1 U1.3), 主板_2 (47 pins), 主板_3 (32 pins)
VCC3V3: 主板_2 (13 pins), 主板_3 (R34.1 R35.1 R36.1 R37.1)
VCC5V: 主板_1 (U1.2 U1.4), 主板_2 (9 pins)
VCCBAT: 主板_2 (7 pins), 主板_3 (8 pins)
10.2: 主板_1 (U1.86), 主板_2 (P4.4)
10.5: 主板_1 (U1.88), 主板_2 (P4.1)
10.6: 主板_1 (U1.89), 主板_2 (P4.3)
11.6: 主板_1 (U1.80), 主板_2 (P4.8)
11.9: 主板_1 (U1.81), 主板_2 (P1.1)
11.10: 主板_1 (U1.82), 主板_2 (P1.3)
11.11: 主板_1 (U1.83), 主板_2 (P1.5)
11.12: 主板_1 (U1.84), 主板_2 (P1.7)
13.0: 主板_1 (U1.74), 主板_2 (P1.9)
13.1: 主板_1 (U1.75), 主板_2 (P1.11)
13.2: 主板_1 (U1.76), 主板_2 (P1.13)
13.3: 主板_1 (U1.77), 主板_2 (P1.15)
15.0: 主板_1 (U1.58), 主板_2 (P1.12)
15.1: 主板_1 (U1.59), 主板_2 (P1.10)
15.2: 主板_1 (U1.60), 主板_2 (P1.14)
15.3: 主板_1 (U1.61), 主板_2 (P1.6)
15.4: 主板_1 (U1.62), 主板_2 (P1.16)
15.5: 主板_1 (U1.63), 主板_2 (P1.8)
15.6: 主板_1 (U1.64), 主板_2 (P2.4)
15.7: 主板_1 (U1.65), 主板_2 (P2.3)
20.0: 主板_1 (U1.44), 主板_2 (R29.2)
20.2: 主板_1 (U1.45), 主板_2 (R28.2)
20.6: 主板_1 (U1.49), 主板_2 (R26.2)
20.7: 主板_1 (U1.50), 主板_2 (R27.2)
20.11: 主板_1 (U1.54), 主板_2 (P3.3)
20.12: 主板_1 (U1.55), 主板_2 (P3.5)
20.13: 主板_1 (U1.56), 主板_2 (P3.6)
20.14: 主板_1 (U1.57), 主板_2 (P3.4)
21.5: 主板_1 (U1.41), 主板_2 (R24.2)
21.6: 主板_1 (U1.42), 主板_2 (R25.2)
33.9: 主板_1 (U1.27), 主板_2 (R30.1)
33.10: 主板_1 (U1.28), 主板_2 (R16.1 R17.1)
BATADC: 主板_1 (U1.113), 主板_2 (FeedBack.5)
BREAK: 主板_1 (U1.53), 主板_2 (Status.3)
CU_A: 主板_1 (U1.120), 主板_2 (FeedBack.1)
CU_B: 主板_1 (U1.119), 主板_2 (FeedBack.2)
CU_C: 主板_1 (U1.118), 主板_2 (FeedBack.3)
CU_SUM: 主板_1 (U1.117), 主板_2 (FeedBack.4)
ENABLE: 主板_1 (U1.52), 主板_2 (Status.2)
ERRLED: 主板_1 (U1.78), 主板_2 (Status.4)
HA: 主板_1 (U1.29), 主板_3 (C26.1 R35.2 R40.1)
HB: 主板_1 (U1.30), 主板_3 (C27.1 R36.2 R39.1)
HC: 主板_1 (U1.31), 主板_3 (C25.1 R34.2 R38.1)
NTC: 主板_1 (U1.115), 主板_3 (R33.1)
PWMAH: 主板_1 (U1.24), 主板_2 (Ctl.1)
PWMAL: 主板_1 (U1.25), 主板_2 (Ctl.2)
PWMBH: 主板_1 (U1.26), 主板_2 (Ctl.3)
PWMBL: 主板_1 (U1.32), 主板_2 (Ctl.4)
PWMCH: 主板_1 (U1.33), 主板_2 (Ctl.5)
PWMCL: 主板_1 (U1.51), 主板_2 (Ctl.6)
RUNLED: 主板_1 (U1.79), 主板_2 (Status.5)
VREF: 主板_1 (U1.116), 主板_2 (FeedBack.6)